# EAGLE schematic Inflow slave (EAGLE 8.6.0)
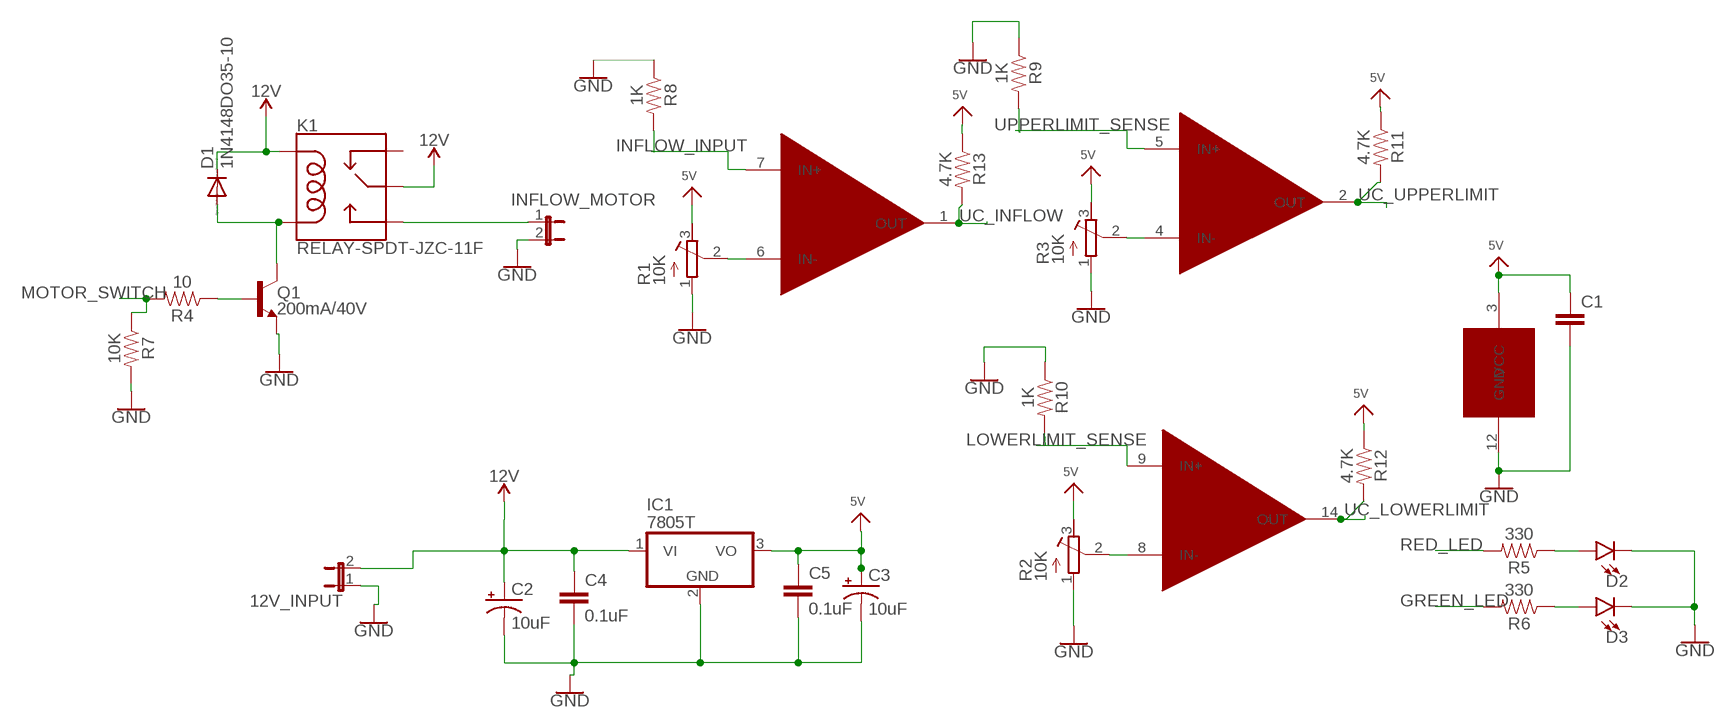
[diagram p0: schematic, sheet 1]

## Parts
12V_INPUT  JUMPER-2PTH  [1X02]
C1  C-EUC0805K  [C0805K]
C2  10uF  10UF-POLAR-RADIAL-2.5MM-25V-20%  [CPOL-RADIAL-2.5MM-5MM]
C3  10uF  10UF-POLAR-RADIAL-2.5MM-25V-20%  [CPOL-RADIAL-2.5MM-5MM]
C4  0.1uF  0.1UF-KIT-EZ-50V-20%  [CAP-PTH-SMALL-KIT]
C5  0.1uF  0.1UF-KIT-EZ-50V-20%  [CAP-PTH-SMALL-KIT]
D1  1N4148DO35-10  [DO35-10]
D2  LED5MM  [LED_5MM]
D3  LED5MM  [LED_5MM]
IC1  7805T  [TO220H]
INFLOW_MOTOR  JUMPER-2PTH  [1X02]
K1  RELAY-SPDT-JZC-11F  [RELAY-JZC]
Q1  200mA/40V  TRANS_NPN-2N3904  [TO-92]
R1  10K  R-TRIMM64W  [RTRIM64W]
R2  10K  R-TRIMM64W  [RTRIM64W]
R3  10K  R-TRIMM64W  [RTRIM64W]
R4  10  10OHM-HORIZ-1/4W-1%  [AXIAL-0.3]
R5  330  330OHM-HORIZ-1/10W-5%  [AXIAL-0.3]
R6  330  330OHM-HORIZ-1/10W-5%  [AXIAL-0.3]
R7  10K  10OHM-HORIZ-1/4W-1%  [AXIAL-0.3]
R8  1K  330OHM-HORIZ-1/10W-5%  [AXIAL-0.3]
R9  1K  330OHM-HORIZ-1/10W-5%  [AXIAL-0.3]
R10  1K  330OHM-HORIZ-1/10W-5%  [AXIAL-0.3]
R11  4.7K  330OHM-HORIZ-1/10W-5%  [AXIAL-0.3]
R12  4.7K  330OHM-HORIZ-1/10W-5%  [AXIAL-0.3]
R13  4.7K  330OHM-HORIZ-1/10W-5%  [AXIAL-0.3]
U$1  LM339_DEV  [DIP14]

## Nets
GND: 12V_INPUT.1 C1.2 C2.2(-) C3.2(-) C4.2 C5.2 D2.K(C) D3.K(C) IC1.2(GND) INFLOW_MOTOR.2 Q1.1(E) R1.1(A) R2.1(A) R3.1(A) R7.P$2 R8.P$1 R9.P$1 R10.P$1 U$1.12(GND)
GREEN_LED: R6.P$2
INFLOW_INPUT: R8.P$2 U$1.7(IN+)
LOWERLIMIT_SENSE: R10.P$2 U$1.9(IN+)
MOTOR_SWITCH: R4.P$2 R7.P$1
N$1: R3.2(S) U$1.4(IN-)
N$2: R2.2(S) U$1.8(IN-)
N$3: R1.2(S) U$1.6(IN-)
N$6: D1.A K1.1(COIL2) Q1.3(C)
N$7: INFLOW_MOTOR.1 K1.3(NO)
N$8: Q1.2(B) R4.P$1
N$10: D2.A R5.P$1
N$11: D3.A R6.P$1
RED_LED: R5.P$2
UC_INFLOW: R13.P$2 U$1.1(OUT)
UC_LOWERLIMIT: R12.P$2 U$1.14(OUT)
UC_UPPERLIMIT: R11.P$2 U$1.2(OUT)
UPPERLIMIT_SENSE: R9.P$2 U$1.5(IN+)
VCC: C1.1 C3.1(+) C5.1 IC1.3(VO) R1.3(E) R2.3(E) R3.3(E) R11.P$1 R12.P$1 R13.P$1 U$1.3(VCC) ; supply symbol labelled 5V
VCC_1: 12V_INPUT.2 C2.1(+) C4.1 D1.C IC1.1(VI) K1.4(MAIN) K1.5(COIL1) ; supply symbol labelled 12V
Unconnected: K1.2(NC) U$1.10(IN-) U$1.11(IN+) U$1.13(OUT)

## Library data of the parts
12V_INPUT INFLOW_MOTOR = SparkFun-Retired:JUMPER-2: Jumper Basic 0.1" spaced jumper. Use with breakaway headers.
C1 = rcl:C-EU: CAPACITOR, European symbol
C2 C3 = SparkFun-Capacitors:10UF-POLAR: 10.0µF polarized capacitors A capacitor is a passive two-terminal electrical component used to store electrical energy temporarily in an electric field.; PROD_ID: CAP-08440
C4 C5 = SparkFun-Capacitors:0.1UF: 0.1µF ceramic capacitors A capacitor is a passive two-terminal electrical component used to store electrical energy temporarily in an electric field.; PROD_ID: CAP-08370
D1 = diode:1N4148: DIODE high speed (Philips)
D2 D3 = SparkFun-LED:LED: LED (Generic) Standard schematic elements and footprints for 5mm, 3mm, 1206, and 0603 sized LEDs. Generic LEDs with no color specified.
IC1 = adafruit:78*: Positive VOLTAGE REGULATOR Added bigger pads to the TO-92 package
K1 = SparkFun-Electromechanical:RELAY-SPDT: SPDT Electromechanical Relay Single-pole, double-throw sealed relays. When current is applied to the coil, it throws a simple changeover switch, terminating the connection from the NC contact to ground and closing the NO contact. Use them to switch high voltage/high current devices. SparkFun Products JQX-15F: Relay SPDT Sealed - 20A <https://www.sparkfun.com/products/10924> (COM-10924) JZC-11F: Relay SPDT Sealed <https://www.sparkfun.com/products/100> (COM-00100); PROD_ID: COMP-09533; SF_SKU: COM-00100
Q1 = SparkFun-DiscreteSemi:TRANS_NPN: NPN transistor Current controlled devices typically used to amplify current or used as a switch. BC547 - COM-08928 <http://www.sparkfun.com/products/8928> (TO-92 45V 100mA) (1.Collector 2.Base 3.Emitter) 2N3904 - COM-00521 <http://www.sparkfun.com/products/521> (TO-92 40V 200mA) (1.Emitter 2.Base 3.Collector) P2N2222A - COM-12852 <http://www.sparkfun.com/products/12852> (TO-92 40V 600mA) (1.Collector 2.Base 3.Emitter); PROD_ID: TRANS-08447
R1-R3 = resistor:R-TRIMM: Trimm resistor
R4 = SparkFun-Resistors:10OHM: 10Ω resistor A resistor is a passive two-terminal electrical component that implements electrical resistance as a circuit element. Resistors act to reduce current flow, and, at the same time, act to lower voltage levels within circuits. - Wikipedia; PROD_ID: RES-12180
R5 R6 = SparkFun-Resistors:330OHM: 330Ω resistor A resistor is a passive two-terminal electrical component that implements electrical resistance as a circuit element. Resistors act to reduce current flow, and, at the same time, act to lower voltage levels within circuits. - Wikipedia; PROD_ID: RES-8371
R7 = SparkFun-Resistors:10OHM: 10Ω resistor A resistor is a passive two-terminal electrical component that implements electrical resistance as a circuit element. Resistors act to reduce current flow, and, at the same time, act to lower voltage levels within circuits. - Wikipedia; PROD_ID: RES-12180; VALUE: 10
R8-R13 = SparkFun-Resistors:330OHM: 330Ω resistor A resistor is a passive two-terminal electrical component that implements electrical resistance as a circuit element. Resistors act to reduce current flow, and, at the same time, act to lower voltage levels within circuits. - Wikipedia; PROD_ID: RES-8371; VALUE: 330
U$1 = LM339_SYM:LM339_DEV